# Altium schematic sheet Internal_Connections.SchDoc
size A4; SheetNumber: 3; SheetTotal: 3
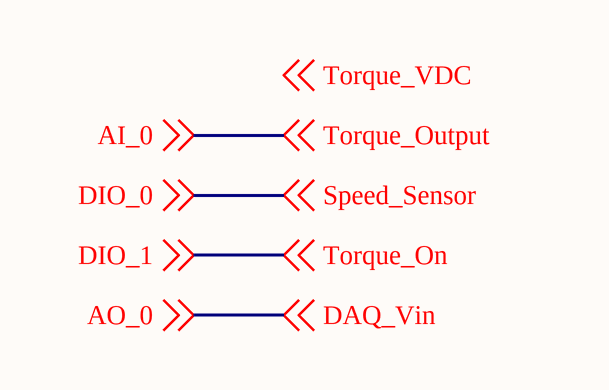
[diagram p0: Internal_Connections.SchDoc]

## Nets
AI_0: off-sheet AI_0, off-sheet Torque_Output  [also labelled Torque_Output]
AO_0: off-sheet AO_0, off-sheet DAQ_Vin  [also labelled DAQ_Vin]
DIO_0: off-sheet DIO_0, off-sheet Speed_Sensor  [also labelled Speed_Sensor]
DIO_1: off-sheet DIO_1, off-sheet Torque_On  [also labelled Torque_On]

## Notes on the sheet
- Labels drawn without touching a wire or pin: Torque_VDC